# EAGLE schematic connectors (EAGLE 6.6.0)

## Sheet 1 of 2
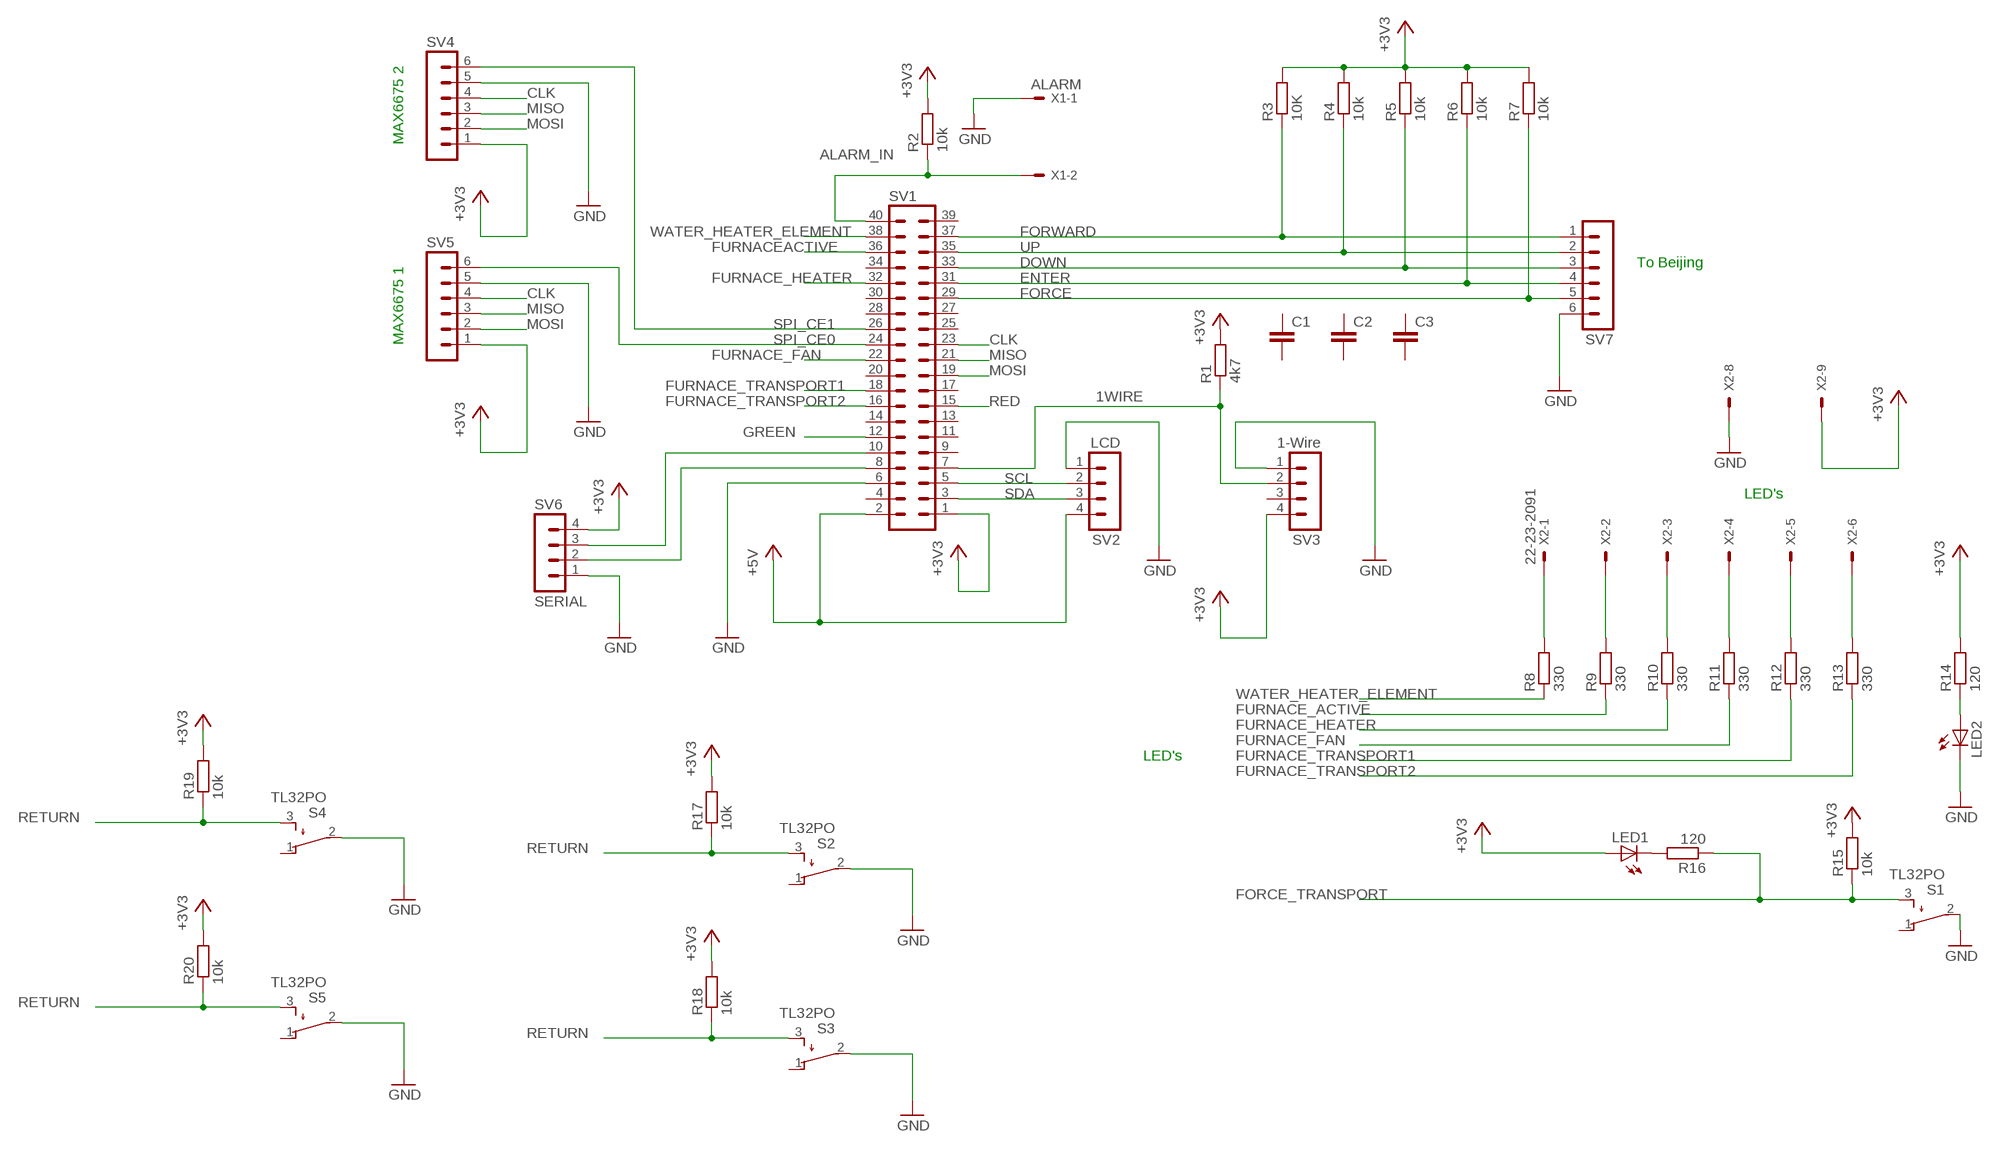
[diagram p0: schematic, sheet 1]

### Parts
C1  C-EU025-024X044  [C025-024X044]
C2  C-EU025-024X044  [C025-024X044]
C3  C-EU025-024X044  [C025-024X044]
LED1  LAP4-BOTTOM  [P47F-BOTTOM]
LED2  LAP4-BOTTOM  [P47F-BOTTOM]
R1  4k7  R-EU_0204/7  [0204/7]
R2  10k  R-EU_0204/7  [0204/7]
R3  10K  R-EU_0204/7  [0204/7]
R4  10k  R-EU_0204/7  [0204/7]
R5  10k  R-EU_0204/7  [0204/7]
R6  10k  R-EU_0204/7  [0204/7]
R7  10k  R-EU_0204/7  [0204/7]
R8  330  R-EU_0204/7  [0204/7]
R9  330  R-EU_0204/7  [0204/7]
R10  330  R-EU_0204/7  [0204/7]
R11  330  R-EU_0204/7  [0204/7]
R12  330  R-EU_0204/7  [0204/7]
R13  330  R-EU_0204/7  [0204/7]
R14  120  R-EU_0204/7  [0204/7]
R15  10k  R-EU_0204/7  [0204/7]
R16  120  R-EU_0204/7  [0204/7]
R17  10k  R-EU_0204/7  [0204/7]
R18  10k  R-EU_0204/7  [0204/7]
R19  10k  R-EU_0204/7  [0204/7]
R20  10k  R-EU_0204/7  [0204/7]
S1  TL32PO  [TL3XPO]
S2  TL32PO  [TL3XPO]
S3  TL32PO  [TL3XPO]
S4  TL32PO  [TL3XPO]
S5  TL32PO  [TL3XPO]
SV1  MA20-2W  [MA20-2W]
SV2  LCD  MA04-1  [MA04-1]
SV3  1-Wire  MA04-1  [MA04-1]
SV4  MA06-1  [MA06-1]
SV5  MA06-1  [MA06-1]
SV6  SERIAL  MA04-1  [MA04-1]
SV7  MA06-1  [MA06-1]
X1  ALARM  22-23-2021  [22-23-2021]
X2  22-23-2091  [22-23-2091]

### Nets
1WIRE: R1.1 SV1.7 SV3.2
+3V3: LED1.A R1.2 R2.2 R3.2 R4.2 R5.2 R6.2 R7.2 R14.2 R15.2 R17.2 R18.2 R19.2 R20.2 SV1.1 SV3.4 SV4.1 SV5.1 SV6.4 X2.9
+5V: SV1.2 SV2.4
ALARM_IN: R2.1 SV1.40 X1.2
CLK: SV1.23 SV4.4 SV5.4
DOWN: R5.1 SV1.33 SV7.3
ENTER: R6.1 SV1.31 SV7.4
FORCE: R7.1 SV1.29 SV7.5
FORCE_TRANSPORT: R15.1 R16.1 S1.3(S)
FORWARD: R3.1 SV1.37 SV7.1
FURNACE_ACTIVE: R9.1
FURNACE_FAN: R11.1 SV1.22
FURNACE_HEATER: R10.1 SV1.32
FURNACE_TRANSPORT1: R12.1 SV1.18
FURNACE_TRANSPORT2: R13.1 SV1.16
FURNACEACTIVE: SV1.36
GND: LED2.C S1.2(P) S2.2(P) S3.2(P) S4.2(P) S5.2(P) SV1.6 SV2.1 SV3.1 SV4.5 SV5.5 SV6.1 SV7.6 X1.1 X2.8
GREEN: SV1.12
MISO: SV1.21 SV4.3 SV5.3
MOSI: SV1.19 SV4.2 SV5.2
N$1: SV1.8 SV6.2
N$2: SV1.10 SV6.3
N$3: LED1.C R16.2
N$4: R8.2 X2.1
N$5: R9.2 X2.2
N$6: R10.2 X2.3
N$7: R11.2 X2.4
N$8: R12.2 X2.5
N$9: R13.2 X2.6
N$10: LED2.A R14.1
RED: SV1.15
RETURN: R17.1 R18.1 R19.1 R20.1 S2.3(S) S3.3(S) S4.3(S) S5.3(S)
SCL: SV1.5 SV2.2
SDA: SV1.3 SV2.3
SPI_CE0: SV1.24 SV5.6
SPI_CE1: SV1.26
UP: R4.1 SV1.35 SV7.2
WATER_HEATER_ELEMENT: R8.1 SV1.38
Unconnected: C1.1 C1.2 C2.1 C2.2 C3.1 C3.2 S1.1(O) S2.1(O) S3.1(O) S4.1(O) S5.1(O) SV1.4 SV1.9 SV1.11 SV1.13 SV1.14 SV1.17 SV1.20 SV1.25 SV1.27 SV1.28 SV1.30 SV1.34 SV1.39 SV3.3 SV4.6 X2.7

### Notes on the sheet
- MAX6675 2
- To Beijing
- MAX6675 1
- LED's
- LED's

## Sheet 2 of 2
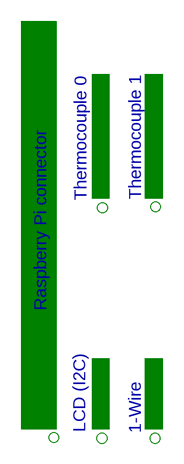
[diagram p1: schematic, sheet 2]

### Notes on the sheet
- Thermocouple 0 | Thermocouple 1
- Raspberry Pi connector
- LCD (I2C) | 1-Wire

## Library data of the parts
C1-C3 = rcl:C-EU: CAPACITOR, European symbol
LED1 LED2 = led:*P4: PointLED® Enhanced Thinfilm LED TOP & BOTTOM mount LS P47F, LR P47F, LA P47F, LY P47F, LT P4SG, LB P4SG, LW P4SG Source: http://catalog.osram-os.com .. LA_LR_LS_LY_P47F_Pb_free.pdf
R1-R20 = rcl:R-EU_: RESISTOR, European symbol
S1-S5 = switch:TL32PO: TINY SWITCH ON - MOM Source: http://www2.produktinfo.conrad.com/datenblaetter/700000-724999/705152-da-01-de-Subminiaturschalter_TL_36YO.pdf
SV1 = con-lstb:MA20-2W: PIN HEADER; OC_FARNELL: unknown; OC_NEWARK: unknown
SV2 SV3 SV6 = con-lstb:MA04-1: PIN HEADER; OC_FARNELL: unknown; OC_NEWARK: unknown
SV4 SV5 SV7 = con-lstb:MA06-1: PIN HEADER; OC_FARNELL: unknown; OC_NEWARK: unknown
X1 = con-molex:22-23-2021: .100" (2.54mm) Center Header - 2 Pin; MF: MOLEX; MPN: 22-23-2021; OC_FARNELL: 1462926; OC_NEWARK: 25C3832
X2 = con-molex:22-23-2091: .100" (2.54mm) Center Header - 9 Pin; MF: MOLEX; MPN: 22-23-2091; OC_FARNELL: 1756827; OC_NEWARK: 56H0450